# EAGLE design EndLightGate2022 (EAGLE 9.6.2)
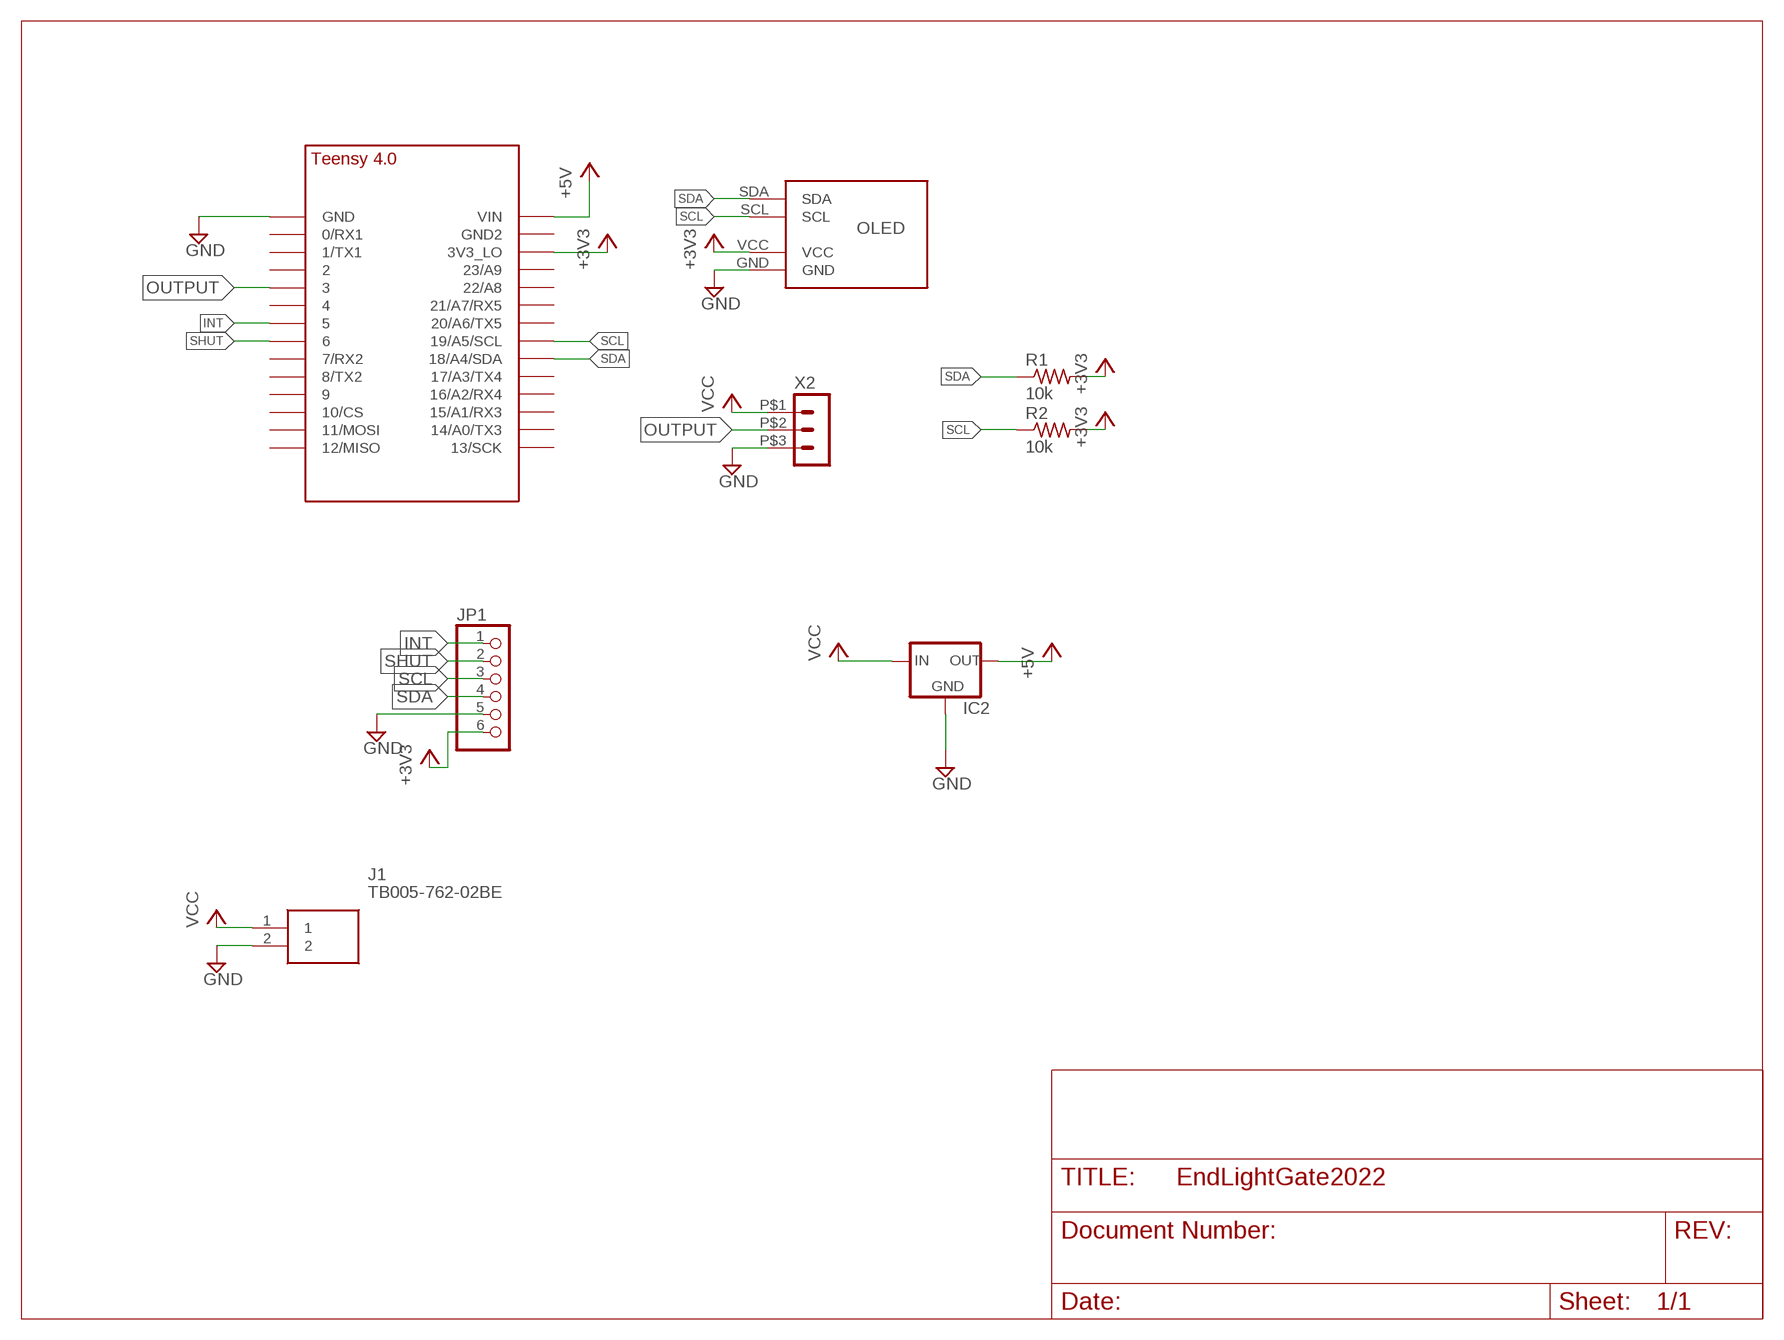
[diagram p0: schematic, sheet 1]

## Parts
IC2  REG_5V_L7805_HOR  [TO-220-H]
J1  TB005-762-02BE  [TB00576202BE]
JP1  PINHD-1X6  [1X06]
R1  10k  RES_AXIAL1/4W-0.4  [1/4W-0.4]
R2  10k  RES_AXIAL1/4W-0.4  [1/4W-0.4]
U$1  TEENSY_4.0_SIMPLE  [TEENSY_4.0_SIMPLE]
U$2  OLED_SSD1306  [OLED_SSD1306]
X2  HEADER_POS3_43650-0300  [43650-0300]

## Nets
+3V3: JP1.6 R1.2 R2.2 U$1.3V3_LO U$2.VCC
+5V: IC2.3(OUT) U$1.VIN
GND: IC2.2(GND) J1.2 JP1.5 U$1.GND U$2.GND X2.P$3
INT: JP1.1 U$1.5
OUTPUT: U$1.3/CANTX X2.P$2
SCL: JP1.3 R2.1 U$1.19/A5/SCL U$2.SCL
SDA: JP1.4 R1.1 U$1.18/A4/SDA U$2.SDA
SHUT: JP1.2 U$1.6
VCC: IC2.1(IN) J1.1 X2.P$1
Unconnected: U$1.0/RX(0/RX1) U$1.1/TX(1/TX1) U$1.2 U$1.4/CANRX U$1.7(7/RX2) U$1.8(8/TX2) U$1.9/CS U$1.10/CS U$1.11/MOSI U$1.12/MISO U$1.13/SCK U$1.14/A0(14/A0/TX3) U$1.15/A1(15/A1/RX3) U$1.16/A2(16/A2/RX4) U$1.17/A3(17/A3/TX4) U$1.20/A6(20/A6/TX5) U$1.21/A7(21/A7/RX5) U$1.22/A8 U$1.23/A9 U$1.GND2

## Library data of the parts
IC2 = GTOR - Active Components:REG_5V_L7805: Voltage Regulator Switching 5v regulator Datasheet <http://power.murata.com/data/power/oki-78sr.pdf> Standard 7805 5V regulator. IGO (Input Ground Output). Spark Fun Electronics SKU : COM-00107 Datasheet <http://www.mouser.com/ds/2/308/MC7800-D-94905.pdf>
J1 = GTOR - Connectors:TB005-762-02BE: Fixed Terminal Blocks screw type, 7.62 , horizontal, 2 poles, CUI Blue, slotted screw, PCB mount Source: Datasheet <https://componentsearchengine.com/Datasheets/1/TB005-762-02BE.pdf>; ARROW_PART_NUMBER: TB005-762-02BE; ARROW_PRICE-STOCK: https://www.arrow.com/en/products/tb005-762-02be/cui-inc; DESCRIPTION: Fixed Terminal Blocks screw type, 7.62 , horizontal, 2 poles, CUI Blue, slotted screw, PCB mount; HEIGHT: 21.7mm; MANUFACTURER_NAME: CUI Inc.; MANUFACTURER_PART_NUMBER: TB005-762-02BE; MOUSER_PART_NUMBER: 490-TB005-762-02BE; MOUSER_PRICE-STOCK: https://www.mouser.co.uk/ProductDetail/CUI-Devices/TB005-762-02BE?qs=vLWxofP3U2zXv1H2wuShow%3D%3D
JP1 = GTOR - Connectors:PINHD-1X6: PIN HEADER
R1 R2 = GTOR - Passive Components:RES_AXIAL: RESISTOR, American symbol; SPICEPREFIX: R
U$1 = GTOR - Microcontroller:TEENSY_4.0_SIMPLE
U$2 = GTOR - Breakout Boards:OLED_SSD1306
X2 = GTOR - Microfit Connector:HEADER_POS3_?: Molex - Micro-Fit 3.0 Series connector, 3.00mm (0.118") pitch header, 3 positions.

## Board
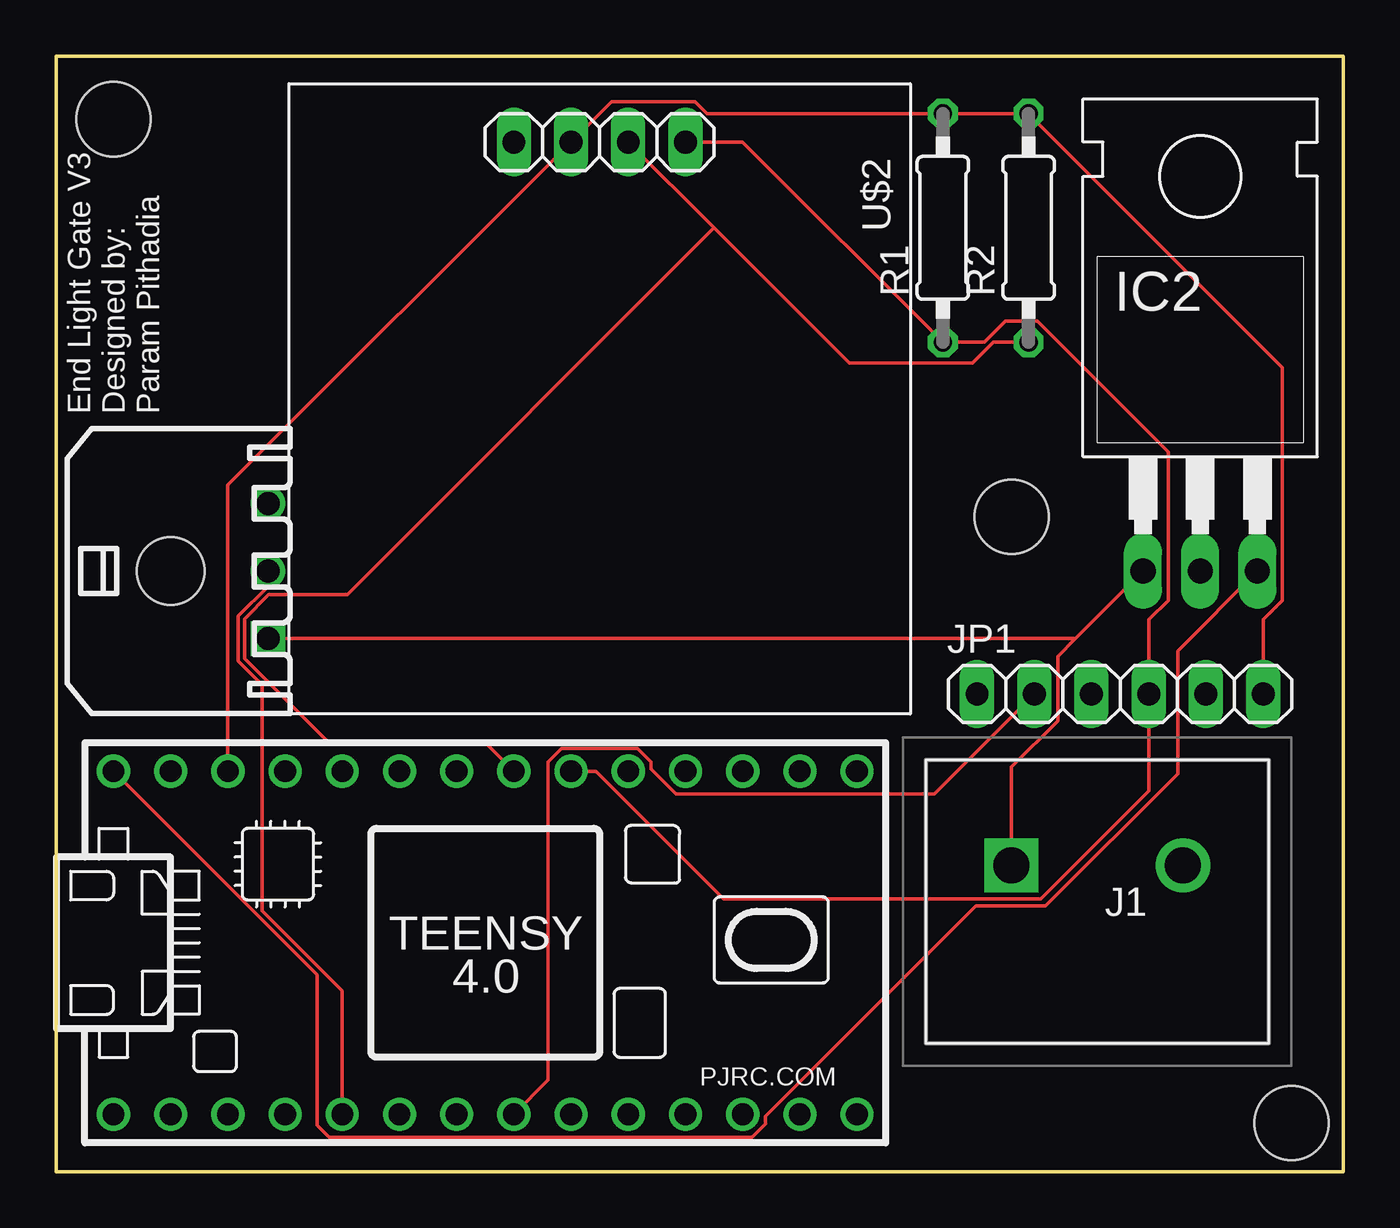
[diagram p1: board, top side]
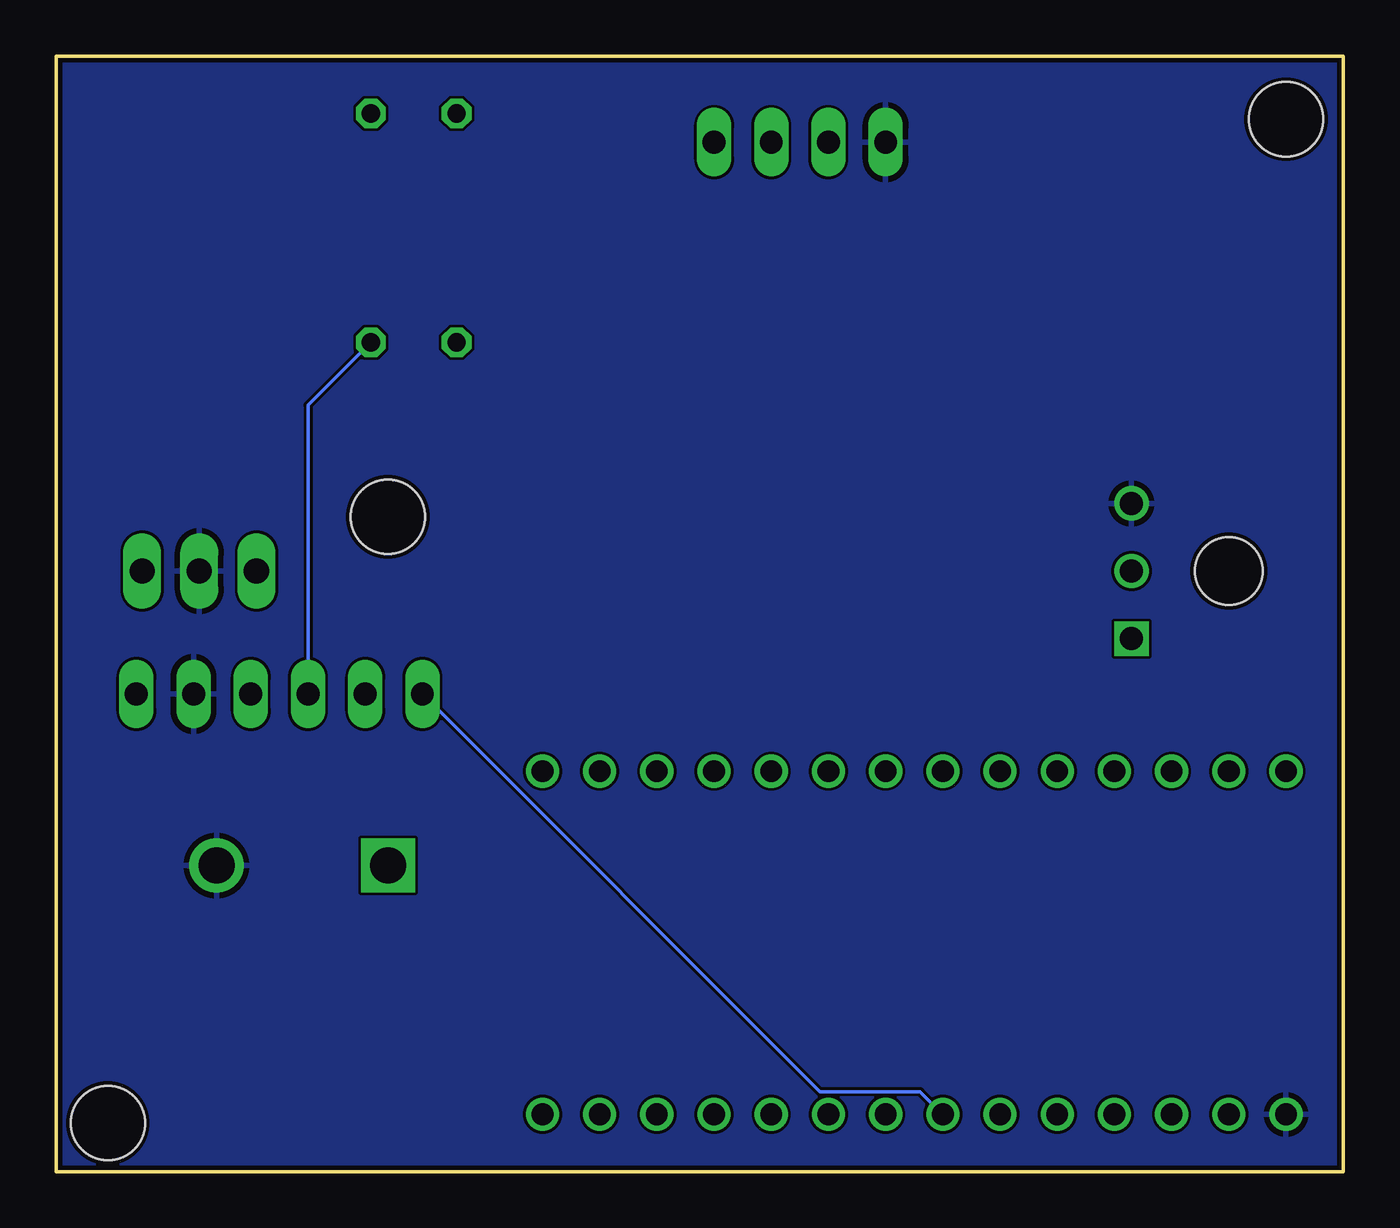
[diagram p2: board, bottom side, seen from below]

Size 57.15 x 49.53 mm. Coordinates in mm from the lower left corner, seen from the top.
Outline: 0,0 0,49.53 57.15,49.53 57.15,0 0,0
Copper layers (1*16): Top 0.035mm / dielectric 1.6mm / Bottom 0.035mm
Design rules "designrulecheck_jlcpcb_2layers": minimum track width 5mil, minimum drill 0.3mm, track to track 5mil, track to pad 0.2mm, pad to pad 5mil, via to via 10mil, smd to smd 5mil, copper to edge 0.2mm, drill to drill 0.5mm, minimum pad ring 10mil, minimum via ring 0.3mm, stop-mask expansion 4mil, vias tented up to drill 0mil, thermal gap 10mil
Holes 3.3 mm at 2.54,46.74 42.42,29.08 54.86,2.16

### Footprints (pad centres in the part's own frame; a part is rotated, then mirrored left to right if it is on the bottom)
TO-220-H = drill 1.118 long: 1 -2.54,-6.35; 2 0,-6.35; 3 2.54,-6.35
TB00576202BE = drill 1.6 pad 2.4 square: 1 0,0 | drill 1.6 pad 2.4: 2 7.62,0
1X06 = drill 1.016 long: 1 -6.35,0; 2 -3.81,0; 3 -1.27,0; 4 1.27,0; 5 3.81,0; 6 6.35,0
1/4W-0.4 = drill 0.813 octagon: 1 -5.08,0; 2 5.08,0
TEENSY_4.0_SIMPLE = drill 0.965: 0/RX -13.97,-7.62; 1/TX -11.43,-7.62; 2 -8.89,-7.62; 3/CANTX -6.35,-7.62; 3V3_LO -11.43,7.62; 4/CANRX -3.81,-7.62; 5 -1.27,-7.62; 6 1.27,-7.62; 7 3.81,-7.62; 8 6.35,-7.62; 9/CS 8.89,-7.62; 10/CS 11.43,-7.62; 11/MOSI 13.97,-7.62; 12/MISO 16.51,-7.62; 13/SCK 16.51,7.62; 14/A0 13.97,7.62; 15/A1 11.43,7.62; 16/A2 8.89,7.62; 17/A3 6.35,7.62; 18/A4/SDA 3.81,7.62; 19/A5/SCL 1.27,7.62; 20/A6 -1.27,7.62; 21/A7 -3.81,7.62; 22/A8 -6.35,7.62; 23/A9 -8.89,7.62; GND -16.51,-7.62; GND2 -13.97,7.62; VIN -16.51,7.62
OLED_SSD1306 = drill 1.016 long: GND 0,-3.81; SCL 0,1.27; SDA 0,3.81; VCC 0,-1.27
43650-0300 = drill 1.02 square: P$1 3,4.32 | drill 1.02: P$2 0,4.32; P$3 -3,4.32 | hole 3: 0,0

### Placement (x,y rotation side)
IC2  50.8,33.02 0 top
J1  42.42,13.59 0 top
JP1  47.24,21.21 0 top
R1  39.37,41.91 90 top
R2  43.18,41.91 90 top
U$1  19.05,10.16 0 top
U$2  24.13,45.72 270 top
X2  5.08,26.67 270 top

### Tracks (layer width: path | path; a pad name or v marks a point on that pad's centre or on a via)
+3V3
  Top 0.152: JP1.6 53.59,24.51 54.45,25.37 54.45,35.72 R2.2 R1.2 28.9,46.99 28.37,47.52 24.66,47.52 U$2.VCC 7.62,30.48 U$1.3V3_LO
+5V
  Top 0.152: IC2.3 49.8,23.13 49.8,17.67 43.92,11.8 40.85,11.8 31.49,2.44 31.49,2.12 30.9,1.53 12.12,1.53 11.59,2.06 11.59,8.73 U$1.VIN
GND
  pour Bottom: -3.81,49.53 -3.81,-1.27 -2.54,-2.54 60.96,-2.54 63.5,0 63.5,50.8 62.23,52.07 -1.27,52.07
INT
  Bottom 0.152: JP1.1 23.24,3.55 18.79,3.55 U$1.5
OUTPUT
  Top 0.127: 12.7,3.17 U$1.3/CANTX
  Top 0.152: 12.7,3.17 12.7,8.02 9.15,11.57 9.15,21.61 8.08,22.68 8.08,24.66 9.4,25.99 X2.P$2
SCL
  Top 0.152: R2.1 41.61,36.83 40.67,35.89 35.23,35.89 29.21,41.91 | U$2.SCL 29.21,41.91 | U$1.19/A5/SCL 19.05,19.05 12.1,19.05 8.36,22.79 8.36,24.55 9.44,25.63 12.93,25.63 29.21,41.91
  Bottom 0.127: 45.97,22.23 JP1.3
  Bottom 0.152: R2.1 45.97,34.04 45.97,22.23
SDA
  Top 0.152: U$2.SDA 30.48,45.72 R1.1 41.22,36.83 42.15,37.77 43.57,37.77 49.37,31.96 49.37,25.37 48.51,24.51 JP1.4 48.51,16.89 43.73,12.11 29.64,12.11 23.97,17.78 U$1.18/A4/SDA
SHUT
  Top 0.152: JP1.2 38.99,16.77 27.52,16.77 26.41,17.88 26.41,18.2 25.82,18.79 22.44,18.79 21.85,18.2 21.85,4.07 U$1.6
VCC
  Top 0.152: X2.P$1 45.26,23.67 | 45.26,23.67 IC2.1 | 45.26,23.67 44.47,22.88 44.47,20.02 42.42,17.96 J1.1

### Text on the board
tPlace: End Light Gate V3 / Designed by: / Param Pithadia